# Altium schematic sheet main.SchDoc
size A3; SheetNumber: 1; SheetTotal: 1
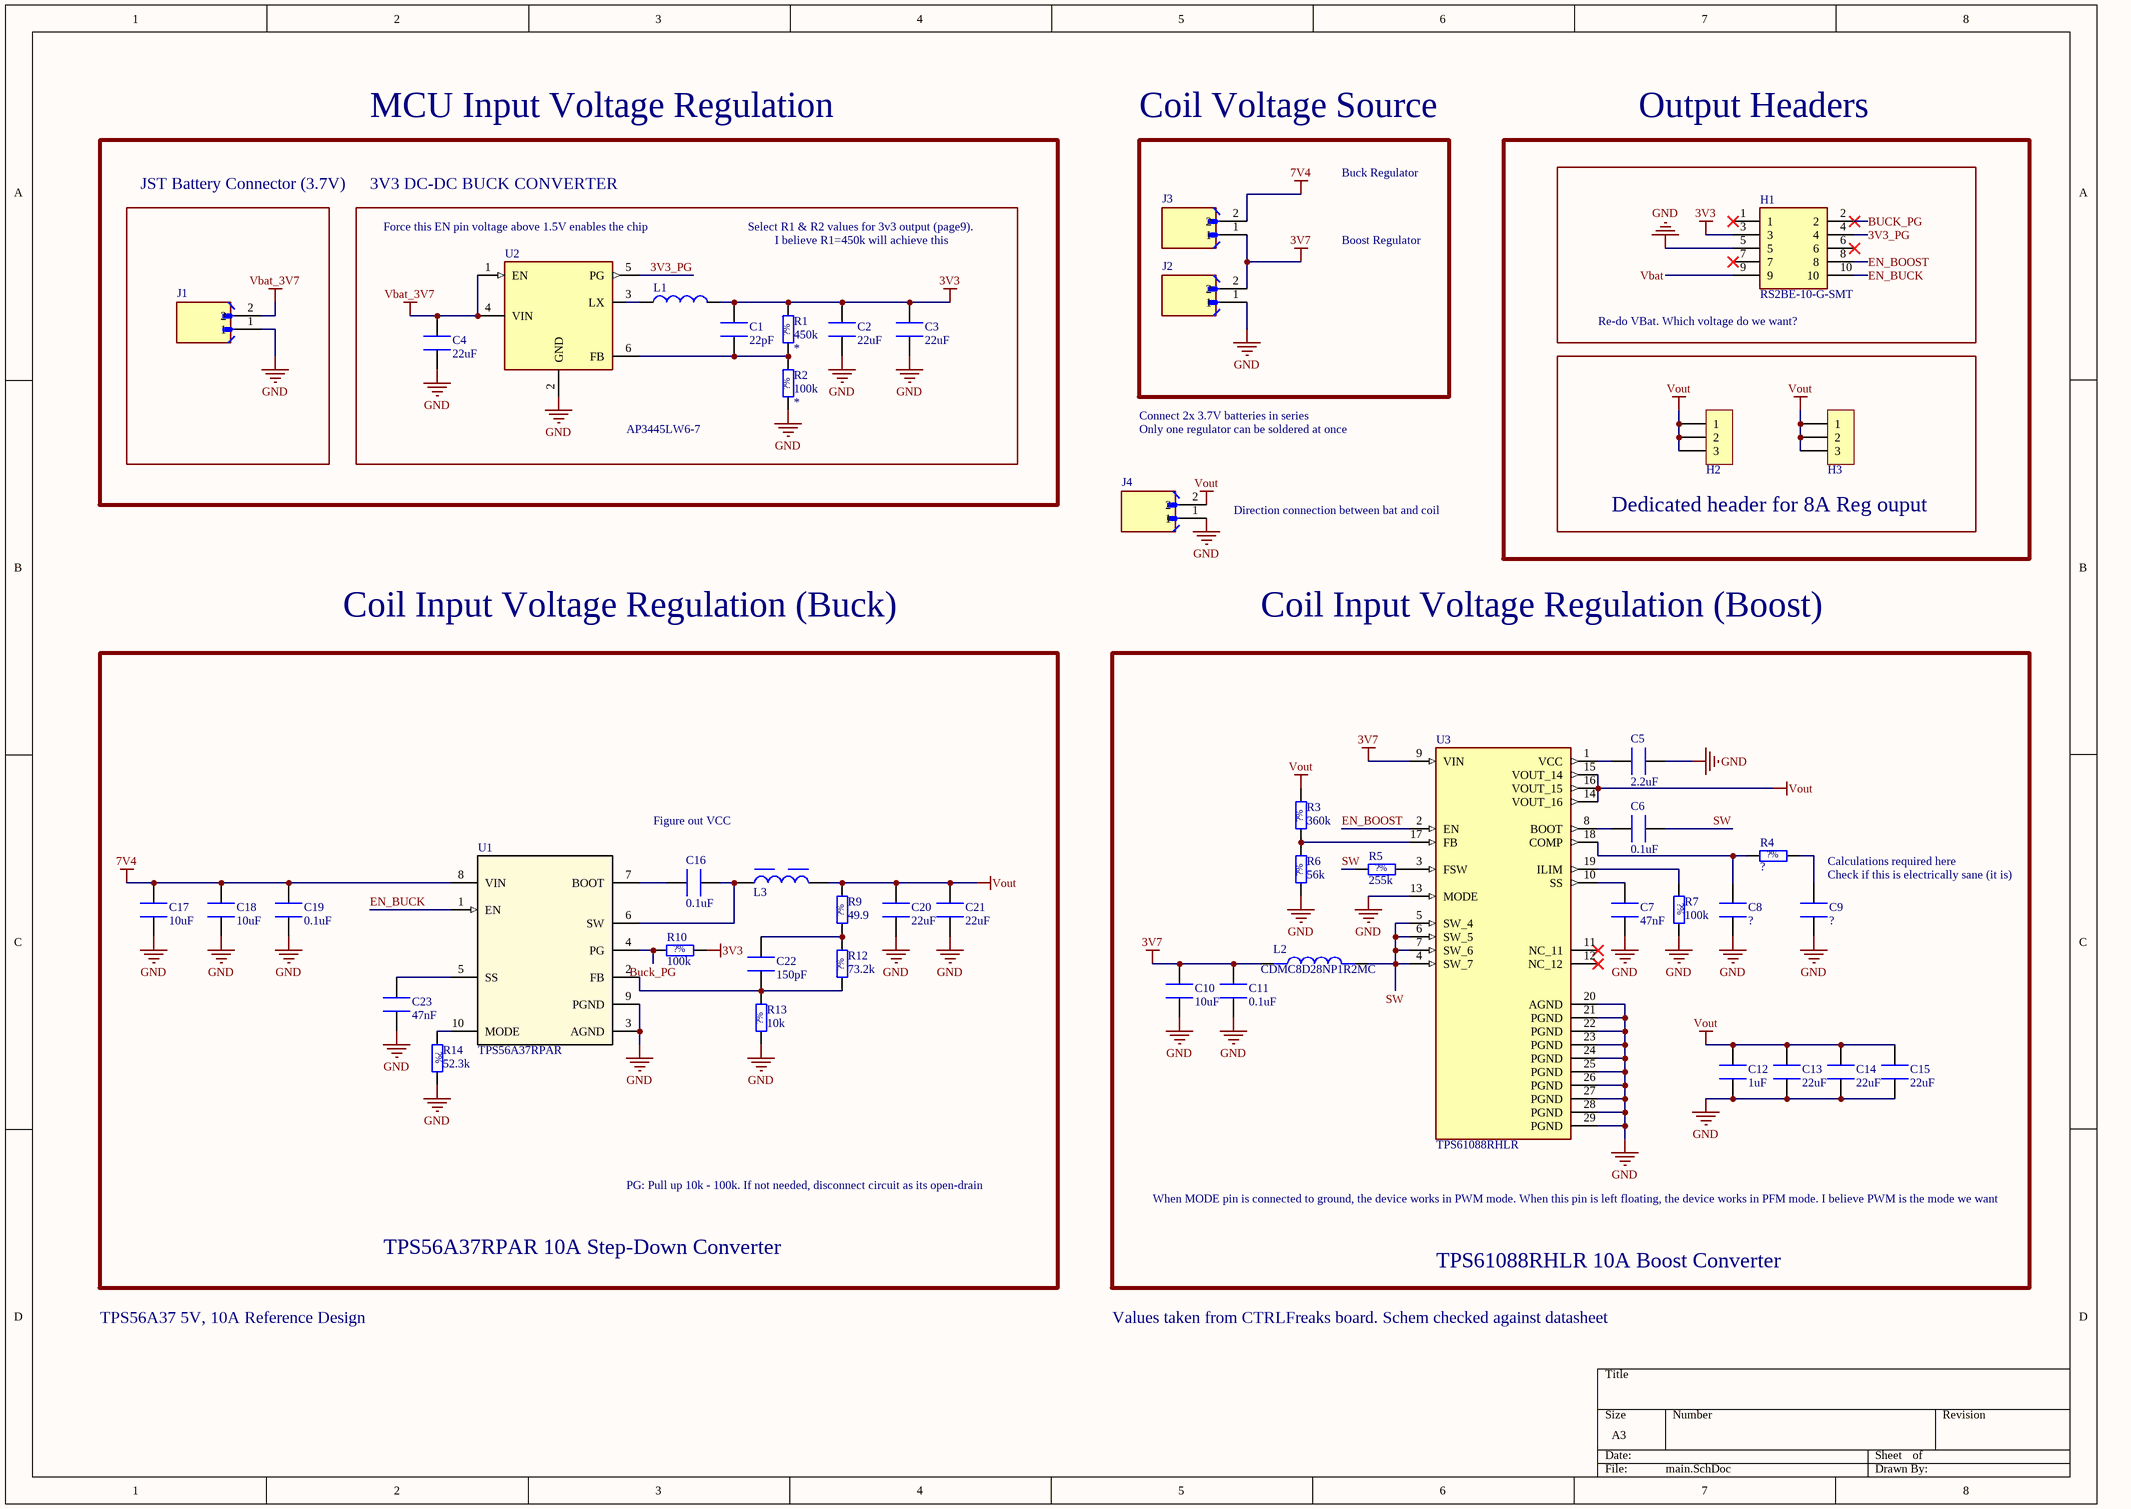
[diagram p0: main.SchDoc]

## Parts
C1  22pF  [CAPACITOR_0805_2012M-70N]
C2  22uF  [CAPACITOR_0805_2012M-70N]
C3  22uF  [CAPACITOR_0805_2012M-70N]
C4  22uF  [CAPACITOR_0805_2012M-70N]
C5  2.2uF  [CAPACITOR_0805_2012M-70N]
C6  0.1uF  [CAPACITOR_0805_2012M-70N]
C7  47nF  [CAPACITOR_0805_2012M-70N]
C8  ?  [CAPACITOR_0805_2012M-70N]
C9  ?  [CAPACITOR_0805_2012M-70N]
C10  10uF  [CAPACITOR_0805_2012M-70N]
C11  0.1uF  [CAPACITOR_0805_2012M-70N]
C12  1uF  [CAPACITOR_0805_2012M-70N]
C13  22uF  [CAPACITOR_0805_2012M-70N]
C14  22uF  [CAPACITOR_0805_2012M-70N]
C15  22uF  [CAPACITOR_0805_2012M-70N]
C16  0.1uF  [CAPACITOR_0805_2012M-70N]
C17  10uF  [CAPACITOR_0805_2012M-70N]
C18  10uF  [CAPACITOR_0805_2012M-70N]
C19  0.1uF  [CAPACITOR_0805_2012M-70N]
C20  22uF  [CAPACITOR_0805_2012M-70N]
C21  22uF  [CAPACITOR_0805_2012M-70N]
C22  150pF  [CAPACITOR_0805_2012M-70N]
C23  47nF  [CAPACITOR_0805_2012M-70N]
H1  RS2BE-10-G-SMT  [RS2BE10GSMT]
H2  HDR,2.54mm,1x3  [HEADER_2.54MM_1x3PIN]  (value not drawn)  (no BOM)
H3  HDR,2.54mm,1x3  [HEADER_2.54MM_1x3PIN]  (value not drawn)  (no BOM)
J1  B2B-PH-K-S(LF)(SN)  [JST_B2B-PH-K-S(LF)(SN)]  (value not drawn)
J2  B2B-PH-K-S(LF)(SN)  [JST_B2B-PH-K-S(LF)(SN)]  (value not drawn)
J3  B2B-PH-K-S(LF)(SN)  [JST_B2B-PH-K-S(LF)(SN)]  (value not drawn)
J4  B2B-PH-K-S(LF)(SN)  [JST_B2B-PH-K-S(LF)(SN)]  (value not drawn)
L1  DFE322520F-2R2M=P2  [INDC3225X200N]  (value not drawn)
L2  CDMC8D28NP1R2MC  [IND_CDMC8D28NP1R2MC]
L3  3.3µH, 16.6A  [WE-HCI_1050]  (value not drawn)
R1  450k  [RESISTOR_0805_2012M-50N]
R2  100k  [RESISTOR_0805_2012M-50N]
R3  360k  [RESISTOR_0805_2012M-50N]
R4  ?  [RESISTOR_0805_2012M-50N]
R5  255k  [RESISTOR_0805_2012M-50N]
R6  56k  [RESISTOR_0805_2012M-50N]
R7  100k  [RESISTOR_0805_2012M-50N]
R9  49.9  [RESISTOR_0805_2012M-50N]
R10  100k  [RESISTOR_0805_2012M-50N]
R12  73.2k  [RESISTOR_0805_2012M-50N]
R13  10k  [RESISTOR_0805_2012M-50N]
R14  52.3k  [RESISTOR_0805_2012M-50N]
U1  TPS56A37RPAR  [RPA0010A-MFG]
U2  AP3445LW6-7  [SOT23-6N-1.4mm]
U3  TPS61088RHLR  [IC_TPS61088RHLR]

## Blocks framed on the sheet
Coil Voltage Source: J2 J3
Re-do VBat. Which voltage do we want?: H1
JST Battery Connector (3.7V): J1
3V3 DC-DC BUCK CONVERTER: C1-C4 L1 R1 R2 U2
Dedicated header for 8A Reg ouput: H2 H3
TPS56A37RPAR 10A Step-Down Converter: C16-C23 L3 R9 R10 R12-R14 U1
TPS61088RHLR 10A Boost Converter: C5-C15 L2 R3-R7 U3

## Nets
3V3: C1.2 C2.2 C3.2 H1.3 L1.2 R1.2 R10.2
3V7: C10.1 C11.1 J2.2 J3.1 L2.1 U3.9(VIN)
7V4: C17.1 C18.1 C19.1 J3.2 U1.8(VIN)
GND: C2.1 C3.1 C4.1 C5.1 C7.2 C8.2 C9.2 C10.2 C11.2 C12.2 C13.2 C14.2 C15.2 C17.2 C18.2 C19.2 C20.2 C21.2 C23.2 H1.5 J1.1 J2.1 J4.1 R2.1 R6.1 R7.2 R13.1 R14.2 U1.3(AGND) U1.9(PGND) U2.2(GND) U3.13(MODE) U3.20(AGND) U3.21(PGND) U3.22(PGND) U3.23(PGND) U3.24(PGND) U3.25(PGND) U3.26(PGND) U3.27(PGND) U3.28(PGND) U3.29(PGND)
Vbat_3V7: C4.2 J1.2 U2.1(EN) U2.4(VIN)
Vout: C12.1 C13.1 C14.1 C15.1 C20.1 C21.1 H2.1 H2.2 H2.3 H3.1 H3.2 H3.3 J4.2 L3.2 R3.2 R9.2 U3.14(VOUT_16) U3.15(VOUT_14) U3.16(VOUT_15)
3V3_PG: H1.4 U2.5(PG)
BUCK_PG: H1.2 R10.1 U1.4(PG)
EN_BOOST: H1.8 U3.2(EN)
EN_BUCK: H1.10 U1.1(EN)
SW: C6.1 L2.2 R5.1 U3.4(SW_7) U3.5(SW_4) U3.6(SW_5) U3.7(SW_6)
Vbat: H1.9
NetC1_1: C1.1 R1.1 R2.2 U2.6(FB)
NetC5_2: C5.2 U3.1(VCC)
NetC6_2: C6.2 U3.8(BOOT)
NetC7_1: C7.1 U3.10(SS)
NetC8_1: C8.1 R4.1 U3.18(COMP)
NetC9_1: C9.1 R4.2
NetC16_1: C16.1 U1.7(BOOT)
NetC16_2: C16.2 L3.1 U1.6(SW)
NetC22_1: C22.1 R12.1 R13.2 U1.2(FB)
NetC22_2: C22.2 R9.1 R12.2
NetC23_1: C23.1 U1.5(SS)
NetL1_1: L1.1 U2.3(LX)
NetR3_1: R3.1 R6.2 U3.17(FB)
NetR5_2: R5.2 U3.3(FSW)
NetR7_1: R7.1 U3.19(ILIM)
NetR14_1: R14.1 U1.10(MODE)

Not connected (* = marked no-connect by the designer): H1 1* 6* 7*; U3 11(NC_11)* 12(NC_12)*

## Notes on the sheet
- MCU Input Voltage Regulation
- Buck Regulator
- Output Headers
- (near U2) Force this EN pin voltage above 1.5V enables the chip
- Select R1 & R2 values for 3v3 output (page9).
- I believe R1=450k will achieve this
- Boost Regulator
- Connect 2x 3.7V batteries in series
- Only one regulator can be soldered at once
- Direction connection between bat and coil
- Coil Input Voltage Regulation (Buck)
- Coil Input Voltage Regulation (Boost)
- Figure out VCC
- (near C9) Check if this is electrically sane (it is)
- Calculations required here
- PG: Pull up 10k - 100k. If not needed, disconnect circuit as its open-drain
- When MODE pin is connected to ground, the device works in PWM mode. When this pin is left floating, the device works in PFM mode. I believe PWM is the mode we want
- TPS56A37 5V, 10A Reference Design
- Values taken from CTRLFreaks board. Schem checked against datasheet

## Library data of the parts
C1-C4 = GRM21BR61E226ME44L: Passive - Capacitor, 0805, 22uF Max, X5R, 25V, ±20%, -55°C ~ 85°C, 0805 (2012 Metric). 9.4uF @ 5V, 3.2uF @ 15V, 1.9uF @ 25V; APSS Standard Part: APSS Standard; Capacitance at Rated Voltage: 10%; Tolerance: ±20%; Temperature Coefficient: X5R; Rated Voltage: 25V; Temp Range: -55°C ~ 85°C; Package: 0805; Supplier 1: Digikey; Supplier 1 Part No.: 490-GRM155R61J224KE01JCT-ND; MF Part No.: GRM21BR61E226ME44L
  C1: Value: 22pF
  C2-C4: Value: 22uF
C5 C6 = C0805C225K8PACTU: Passive - Capacitor, X5R, 2.2uF Max, 10V, 0805 (2012 Metric), ±10%, -55°C ~ 85°C. 2uF @ 5V, 1.1uF @ 10V; APSS Standard Part: APSS Standard; Capacitance at Rated Voltage: 50%; Tolerance: ±10%; Temperature Coefficient: X5R; Rated Voltage: 10V; Temp Range: -55°C ~ 85°C; Package: 0805; Supplier 1: Digikey; Supplier 1 Part No.: 399-C0805C225K8PACTUCT-ND; MF Part No.: C0805C225K8PACTU
  C5: Value: 2.2uF
  C6: Value: 0.1uF
C7-C23 = GRM21BR61E226ME44L: Passive - Capacitor, Generic; APSS Standard Part: APSS Standard; Tolerance: ±20%; Temperature Coefficient: X5R; Capacitance at Rated Voltage: 10%; Rated Voltage: 25V; Temp Range: -55°C ~ 85°C; Package: 0805; Supplier 1: Digikey; Supplier 1 Part No.: 490-GRM155R61J224KE01JCT-ND; MF Part No.: GRM21BR61E226ME44L
  C7 C23: Value: 47nF
  C8 C9: Value: ?
  C10 C17 C18: Value: 10uF
  C11 C16 C19: Value: 0.1uF
  C12: Value: 1uF
  C13-C15 C20 C21: Value: 22uF
  C22: Value: 150pF
H1 = RS2BE-10-G-SMT: Receptacle Strip 10P 2.54mm Pitch SMT; Manufacturer_Name: Adam Tech; Geometry.Height: 5.05mm; Manufacturer_Part_Number: RS2BE-10-G-SMT; Mouser Part Number: *; Mouser Price/Stock: *; Arrow Part Number: *; Arrow Price/Stock: *; Datasheet Link: *
H2 H3 = HDR,2.54mm,1x3: Connector - 2.54mm, 1x3-pin
J1-J4 = B2B-PH-K-S(LF)(SN): Connector Header Through Hole 2 position 0.079 (2.00mm); MF: JST; SnapEDA_Link: https://www.snapeda.com/parts/B2B-PH-K-S%20(LF)(SN)/JST/view-part/?ref=snap; Package: None; Value: *; MP: B2B-PH-K-S (LF)(SN); Check_prices: https://www.snapeda.com/parts/B2B-PH-K-S%20(LF)(SN)/JST/view-part/?ref=eda
L1 = DFE322520F-2R2M=P2: 2.2 H Shielded Wirewound Inductor 3.3 A 40mOhm Max 1210 (3225 Metric); Manufacturer_Name: Murata Electronics; Geometry.Height: 2mm; Avnet Part Number: *; Avnet Price/Stock: *; Manufacturer_Part_Number: DFE322520F-2R2M=P2; Datasheet Link: https://www.murata.com/-/media/webrenewal/support/library/catalog/products/inductor/chip/o05e.ashx?la=en-us
L2 = CDMC8D28NP1R2MC: Inductor Power Shielded Wirewound 1.2uH 20% 1MHz 12.9A 0.007Ohm DCR T/R; MF: Sumida; SnapEDA_Link: https://www.snapeda.com/parts/CDMC8D28NP1R2MC/Sumida/view-part/?ref=snap; Package: None; Value: *; MP: CDMC8D28NP1R2MC; Check_prices: https://www.snapeda.com/parts/CDMC8D28NP1R2MC/Sumida/view-part/?ref=eda
L3 = 744325330: WE-HCI SMT Flat Wire High Current Inductor, size 1050, 3.3µH, 16.6A, 5.9mΩ; Manufacturer: Wurth Elektronik; Case/Size Code: 1050; Material: Superflux; Saturation Current: 15A; Self Resonant Frequency: 54MHz; Manufacturer Part Number: 744325330; Category: Shielded Power Inductors; Match Code: WE-HCI; ComponentLink1Description: Website Link; ComponentLink1URL: https://www.we-online.com/redexpert/article/744325330?ad; ComponentLink2Description: Datasheet Link; ComponentLink2URL: https://www.we-online.com/redexpert/spec/744325330?ad; Mount: Surface Mount; Operating Temperature Max: 150°C; Operating Temperature Min: -40°C; Packaging: Tape and Reel; Length: 10.2mm; Width: 10.2mm; Height: 4.7mm; DC Resistance: 5.9mΩ; Inductance: 3.3µH; Performance Rated Current: 16.6A
R1-R7 R9 R10 R12-R14 = Generic Resistor: Passive - Resistor, Generic; Tolerance: ?%
  R1: MF Part No.: *; Value: 450k
  R2: MF Part No.: *; Value: 100k
  R3: Value: 360k
  R4: Value: ?
  R5: Value: 255k
  R6: Value: 56k
  R7 R10: Value: 100k
  R9: Value: 49.9
  R12: Value: 73.2k
  R13: Value: 10k
  R14: Value: 52.3k
U1 = TPS56A37RPAR: 4.5V to 28V input, 10A synchronous buck converter 10-VQFN-HR -40 to 150; Manufacturer_Name: Texas Instruments; TYPE: TYPE; RefDes: RefDes; Copyright: Copyright (C) 2026 Ultra Librarian. All rights reserved.; Manufacturer_Part_Number: TPS56A37RPAR; Datasheet: https://www.ti.com/lit/gpn/tps56a37
U2 = AP3445LW6-7: IC - Regulator, Buck, 2A, 2.7V to 5.5V In, 0.6V to Vin Out, SOT23-6; APSS Standard Part: APSS Standard; Temp Range: -40°C ~ 85°C (TA); MF Part No.: AP3445LW6-7; Package: SOT-23-5; Supplier 1: Digikey; Supplier 1 Part No.: AP3445LW6-7DICT-ND; Rated Voltage: 5.5V
U3 = TPS61088RHLR: MP: TPS61088RHLR; Availability: Unavailable; Value: *; Package: None; Price: None